# EAGLE design tomu-pro-micro (EAGLE 8.7.1)
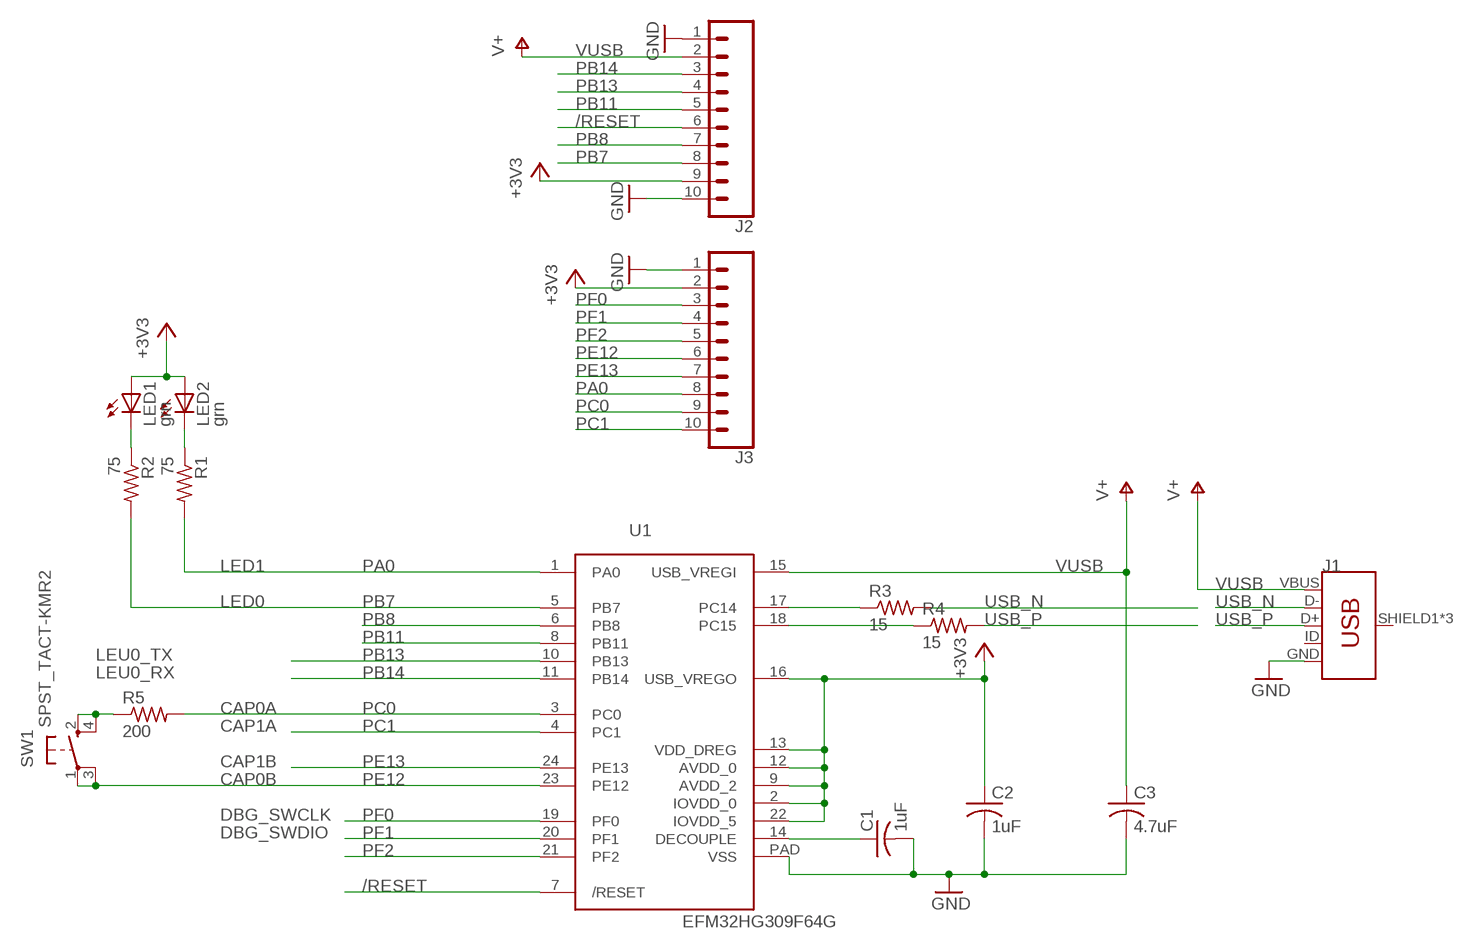
[diagram p0: schematic, sheet 1]

## Parts
C1  1uF  C-USC0603  [C0603]
C2  1uF  C-USC0603  [C0603]
C3  4.7uF  C-USC0603  [C0603]
J1  USB_MICRO-B_FEMALE-SMT  [USB-B-MICRO-SMD]
J2  CONN_10"  [1X10]
J3  CONN_10"  [1X10]
LED1  grn  LEDCHIP-LED0603  [CHIP-LED0603]
LED2  grn  LEDCHIP-LED0603  [CHIP-LED0603]
R1  75  R-US_R0603  [R0603]
R2  75  R-US_R0603  [R0603]
R3  15  R-US_R0603  [R0603]
R4  15  R-US_R0603  [R0603]
R5  200  R-US_R0603  [R0603]
SW1  SPST_TACT-KMR2  [KMR2]
U1  EFM32HG309F64G  [QFN24PAD]

## Nets
+3V3: C2.1 J2.9 J3.2 LED1.A LED2.A U1.2(IOVDD_0) U1.9(AVDD_2) U1.12(AVDD_0) U1.13(VDD_DREG) U1.16(USB_VREGO) U1.22(IOVDD_5)
/RESET: J2.6 U1.7(/RESET)
DECOUPLE: C1.1 U1.14(DECOUPLE)
GND: C1.2 C2.2 C3.2 J1.GND J2.1 J2.10 J3.1 U1.PAD(VSS)
N$4: LED1.C R2.1
N$5: LED2.C R1.1
N$20: R5.1 SW1.2(S) SW1.4(S1)
PA0: J3.8 R1.2 U1.1(PA0)
PB7: J2.8 R2.2 U1.5(PB7)
PB8: J2.7 U1.6(PB8)
PB11: J2.5 U1.8(PB11)
PB13: J2.4 U1.10(PB13)
PB14: J2.3 U1.11(PB14)
PC0: J3.9 R5.2 U1.3(PC0)
PC1: J3.10 U1.4(PC1)
PE12: J3.6 SW1.1(P) SW1.3(P1) U1.23(PE12)
PE13: J3.7 U1.24(PE13)
PF0: J3.3 U1.19(PF0)
PF1: J3.4 U1.20(PF1)
PF2: J3.5 U1.21(PF2)
RUSB_N: R3.1 U1.17(PC14)
RUSB_P: R4.1 U1.18(PC15)
USB_N: J1.D- R3.2
USB_P: J1.D+ R4.2
VUSB: C3.1 J1.VBUS J2.2 U1.15(USB_VREGI) ; supply symbol labelled V+
Unconnected: J1.ID J1.SHIELD1(SHIELD) J1.SHIELD2(SHIELD) J1.SHIELD3(SHIELD)

## Notes on the sheet
- LED1
- LED0
- LEU0_TX
- LEU0_RX
- CAP0A
- CAP1A
- CAP1B
- CAP0B
- DBG_SWCLK
- DBG_SWDIO

## Library data of the parts
C1-C3 = adafruit:C-US: CAPACITOR, American symbol
J1 = SparkFun-Connectors:USB_MICRO-B: USB Type Micro-B Connector Male/female and PTH/SMT variants SparkFun Products: SparkFun microB USB Breakout <https://www.sparkfun.com/products/12035> SparkFun USB microB Plug Breakout <https://www.sparkfun.com/products/10031> SparkFun ESP8266 Thing <https://www.sparkfun.com/products/13231>; PROD_ID: CONN-11752
J2 J3 = SparkFun-Connectors:CONN_10: Multi connection point. Often used as Generic Header-pin footprint for 0.1 inch spaced/style header connections On any of the 0.1 inch spaced packages, you can populate with these: Break Away Headers - Straight <https://www.sparkfun.com/products/116> (PRT-00116) Break Away Male Headers - Right Angle <https://www.sparkfun.com/products/553> (PRT-00553) Female Headers <https://www.sparkfun.com/products/115> (PRT-00115) Break Away Headers - Machine Pin <https://www.sparkfun.com/products/117> (PRT-00117) Break Away Female Headers - Swiss Machine Pin <https://www.sparkfun.com/products/743> (PRT-00743) Arduino Stackable Header - 10 Pin <https://www.sparkfun.com/products/11376> (PRT-11376) For SCREWTERMINALS and SPRING TERMINALS visit here: Screw Terimnals on SparkFun.com <https://www.sparkfun.com/search/results?term=Screw+Terminals> (5mm/3.5mm/2.54mm spacing) This device is also useful as a general connection point to wire up your design to another part of your project. Our various solder wires solder well into these plated through hole pads. Hook-Up Wire - Assortment (Stranded, 22 AWG) <https://www.sparkfun.com/products/11375> (PRT-11375) Hook-Up Wire - Assortment (Solid Core, 22 AWG) <https://www.sparkfun.com/products/11367> (PRT-11367) View the entire wire category on our website here <https://www.sparkfun.com/categories/141> Special notes: Molex polarized connector foot print use with SKU : PRT-08231 with associated crimp pins and housings. 1MM SMD Version SKU: PRT-10208 NOTES ON THE VARIANTS LOCK and LOCK_LONGPADS... This footprint was designed to help hold the alignment of a through-hole component (i.e. 6-pin header) while soldering it into place. You may notice that each hole has been shifted either up or down by 0.005 of an inch from it's more standard position (which is a perfectly straight line). This slight alteration caused the pins (the squares in the middle) to touch the edges of the holes. Because they are alternating, it causes a "brace" to hold the component in place. 0.005 has proven to be the perfect amount of "off-center" position when using our standard breakaway headers. Although looks a little odd when you look at the bare footprint, once you have a header in there, the alteration is very hard to notice. Also,if you push a header all the way into place, it is covered up entirely on the bottom side.; PROD_ID: CONN-11563
LED1 LED2 = adafruit:LED: LED OSRAM: - CHIPLED LG R971, LG N971, LY N971, LG Q971, LY Q971, LO R971, LY R971 LH N974, LH R974 LS Q976, LO Q976, LY Q976 LO Q996 - Hyper CHIPLED LW Q18S LB Q993, LB Q99A, LB R99A - SideLED LS A670, LO A670, LY A670, LG A670, LP A670 LB A673, LV A673, LT A673, LW A673 LH A674 LY A675 LS A676, LA A676, LO A676, LY A676, LW A676 LS A679, LY A679, LG A679 - Hyper Micro SIDELED® LS Y876, LA Y876, LO Y876, LY Y876 LT Y87S - SmartLED LW L88C, LW L88S LB L89C, LB L89S, LG L890 LS L89K, LO L89K, LY L89K LS L896, LA L896, LO L896, LY L896 - TOPLED LS T670, LO T670, LY T670, LG T670, LP T670 LSG T670, LSP T670, LSY T670, LOP T670, LYG T670 LG T671, LOG T671, LSG T671 LB T673, LV T673, LT T673, LW T673 LH T674 LS T676, LA T676, LO T676, LY T676, LB T676, LH T676, LSB T676, LW T676 LB T67C, LV T67C, LT T67C, LS T67K, LO T67K, LY T67K, LW E67C LS E67B, LA E67B, LO E67B, LY E67B, LB E67C, LV E67C, LT E67C LW T67C LS T679, LY T679, LG T679 LS T770, LO T770, LY T770, LG T770, LP T770 LB T773, LV T773, LT T773, LW T773 LH T774 LS E675, LA E675, LY E675, LS T675 LS T776, LA T776, LO T776, LY T776, LB T776 LHGB T686 LT T68C, LB T68C - Hyper Mini TOPLED® LB M676 - Mini TOPLED Santana® LG M470 LS M47K, LO M47K, LY M47K Source: http://www.osram.convergy.de/
R1-R5 = adafruit:R-US_: RESISTOR, American symbol
SW1 = adafruit:SPST_TACT: SMT 6mm switch, EVQQ2 series http://www.ladyada.net/library/eagle
U1 = todstuff:EFM32HG309F64G

## Board
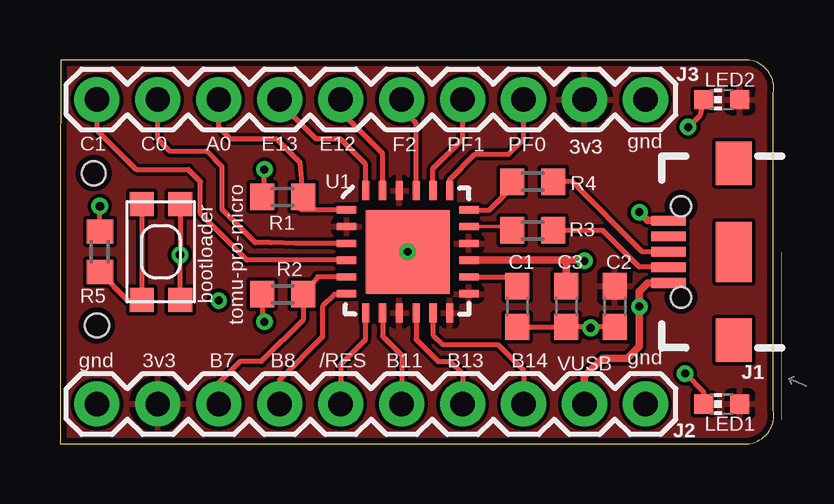
[diagram p1: board, top side]
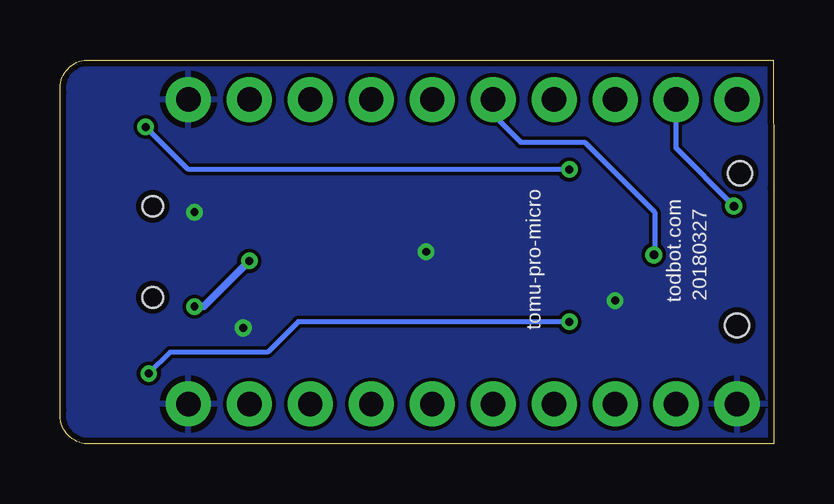
[diagram p2: board, bottom side, seen from below]

Size 29.74 x 16 mm. Coordinates in mm from the lower left corner, seen from the top.
Outline: 29.73,1.38 29.73,14.62 arc90 28.73,16 0.03,16 arc1 0.01,0 28.73,0 arc90 29.73,1.38
Copper layers (1*16): Top 0.0356mm / dielectric 1.5011mm / Bottom 0.0356mm
Design rules "LaenPCBOrderTodTent *": minimum track width 6mil, minimum drill 13mil, track to track 6mil, track to pad 6mil, pad to pad 6mil, via to via 6mil, smd to smd 6mil, copper to edge 10mil, drill to drill 6mil, minimum pad ring 7mil, minimum via ring 7mil, stop-mask expansion 3mil, vias tented up to drill 20mil, thermal gap 10mil
Holes 1 mm at 1.53,4.93 1.41,11.28

### Footprints (pad centres in the part's own frame; a part is rotated, then mirrored left to right if it is on the bottom)
C0603 = smd 1.1 x 1: 1 -0.85,0; 2 0.85,0
USB-B-MICRO-SMD = smd 1.45 x 0.4: D+ 2.725,0; D- 2.725,0.65; GND 2.725,-1.3; ID 2.725,-0.65; VBUS 2.725,1.3 | smd 1.5 x 1.8: SHIELD1 0,3.685; SHIELD2 0,-3.685 | smd 1.5 x 2.5: SHIELD3 0,0 | hole 0.85: 2.2,1.9; 2.2,-1.9
1X10 = drill 1.016 pad 1.88: 1 0,0; 2 2.54,0; 3 5.08,0; 4 7.62,0; 5 10.16,0; 6 12.7,0; 7 15.24,0; 8 17.78,0; 9 20.32,0; 10 22.86,0
CHIP-LED0603 = smd 0.8 x 0.8: A 0,-0.75; C 0,0.75
R0603 = smd 1 x 1.1: 1 -0.85,0; 2 0.85,0
KMR2 = smd 1 x 1: 1 2,0.8; 2 2,-0.8; 3 -2,0.8; 4 -2,-0.8
QFN24PAD = smd 0.8 x 0.3: 1 -2.55,1.75; 2 -2.55,1.05; 3 -2.55,0.35; 4 -2.55,-0.35; 5 -2.55,-1.05; 6 -2.55,-1.75; 13 2.55,-1.75; 14 2.55,-1.05; 15 2.55,-0.35; 16 2.55,0.35; 17 2.55,1.05; 18 2.55,1.75 | smd 0.3 x 0.8: 7 -1.75,-2.55; 8 -1.05,-2.55; 9 -0.35,-2.55; 10 0.35,-2.55; 11 1.05,-2.55; 12 1.75,-2.55; 19 1.75,2.55; 20 1.05,2.55; 21 0.35,2.55; 22 -0.35,2.55; 23 -1.05,2.55; 24 -1.75,2.55 | smd 3.5 x 3.5: PAD 0,0

### Placement (x,y rotation side)
C1  19.06,5.71 270 top
C2  23.12,5.71 270 top
C3  21.09,5.71 270 top
J1  28.08,8 180 top
J2  24.39,1.65 180 top
J3  24.39,14.35 180 top
LED1  27.57,1.65 90 top
LED2  27.57,14.35 90 top
R1  9.28,10.29 0 top
R2  9.28,6.22 0 top
R3  19.69,8.89 0 top
R4  19.69,10.92 0 top
R5  1.66,8 90 top
SW1  4.2,8 270 top
U1  14.49,8 0 top

### Tracks (layer width: path | path; a pad name or v marks a point on that pad's centre or on a via)
+3V3
  pour Top: -0.24,15.88 30.74,15.88 30.74,-0.63 -0.24,-0.63
/RESET
  Top 0.203: U1.7 12.71,5.42 12.71,4.32 11.69,3.3 J2.6
DECOUPLE
  Top 0.203: U1.14 18.67,6.95 C1.1
GND  (via drill 0.33, 0.35)
  Top 0.152: C2.2 22.15,4.86 v22.11,4.83
  Top 0.203: C1.2 C3.2 C2.2
  Top 0.305: J1.GND 24.49,9.3 v24.14,9.65
  other vias: 14.49,8 6.61,5.97
  pour Bottom: -0.24,-0.13 -0.24,16 29.73,16 29.73,-0.13
N$4  (via drill 0.33)
  Top 0.203: R2.1 8.43,5.17 v8.52,5.08 | v26.04,2.92 26.82,2.15 LED1.C
  Bottom 0.203: v8.52,5.08 19.82,5.08 21.09,3.81 25.16,3.81 v26.04,2.92
N$5  (via drill 0.33)
  Top 0.203: v26.17,13.21 26.69,13.73 LED2.C | R1.1 8.52,10.38 v8.52,11.43
  Bottom 0.203: v8.52,11.43 24.39,11.43 v26.17,13.21
N$20
  Top 0.203: SW1.4 SW1.2 2.81,6 R5.1
PA0
  Top 0.203: U1.1 10.03,9.75 R1.2 10,11.72 9.03,12.7 7.12,12.7 6.61,13.21 J3.8
PB7
  Top 0.203: U1.5 10.73,6.95 R2.2 10.13,5.17 8.39,3.43 7.5,3.43 6.61,2.54 J2.8
PB8
  Top 0.203: U1.6 11.91,6.22 11.44,6.22 10.93,5.71 10.93,5.33 10.93,4.44 9.15,2.67 J2.7
PB11
  Top 0.203: U1.8 13.44,4.48 14.23,3.68 J2.5
PB13
  Top 0.203: U1.10 14.84,4.35 15.76,3.43 16.27,3.43 16.77,2.92 J2.4
PB14
  Top 0.203: U1.11 15.54,4.54 15.95,4.13 18.23,4.13 19.31,3.05 J2.3
PC0  (via drill 0.35)
  Top 0.203: U1.3 9.82,8.35 8.77,8.38 8.14,8.38 6.74,9.78 6.74,11.56 6.11,12.19 4.58,12.19 4.07,12.7 J3.9 | R5.2 v1.66,9.91
  Bottom 0.203: J3.9 4.07,12.32 v1.66,9.91
PC1
  Top 0.203: U1.4 7.79,7.65 5.85,9.59 5.85,10.92 5.34,11.43 3.18,11.43 1.53,13.08 J3.10
PE12  (via drill 0.35)
  Top 0.203: J3.6 11.69,13.84 13.44,12.1 U1.23 | SW1.1 v5,7.87 SW1.3
  Bottom 0.203: J3.6 11.69,13.72 10.55,12.57 7.88,12.57 4.96,9.65 4.96,8.04 v5,7.87
PE13
  Top 0.203: U1.24 12.74,11.66 11.69,12.7 10.68,12.7 9.15,14.22 J3.7
PF0
  Top 0.203: U1.19 16.24,11.02 17.28,12.06 18.68,12.06 19.31,12.7 J3.3
PF1
  Top 0.203: U1.20 15.54,11.46 16.77,12.7 J3.4
PF2
  Top 0.203: J3.5 14.23,13.97 14.84,13.37 U1.21
RUSB_N
  Top 0.152: U1.17 18.68,9.05 R3.1
RUSB_P
  Top 0.203: U1.18 17.89,9.75 18.84,10.71 R4.1
USB_N
  Top 0.203: J1.D- 25.34,7.37 24.14,7.37 22.62,8.89 R3.2
USB_P
  Top 0.203: J1.D+ 24.27,8 21.35,10.92 R4.2
VUSB  (via drill 0.33)
  Top 0.203: 21.82,7.65 v21.85,7.62
  Top 0.305: J2.2 21.85,2.79 22.62,3.56 23.63,3.56 24.14,4.06 v24.14,5.71 24.14,6.35 24.49,6.7 J1.VBUS | U1.15 21.09,7.65 | 21.09,7.65 21.82,7.65 | C3.1 21.09,7.65
  Bottom 0.305: v24.14,5.71 23.76,5.71 v21.85,7.62

### Text on the board
tPlace: C1 | C0 | A0 | E13 | E12 | 3v3 | 3v3 | F2 | PF1 | PF0 | gnd | bootloader | tomu-pro-micro | gnd | 3v3 | B7 | B8 | /RES | B11 | B13 | B14 | VUSB | gnd
bPlace: 20180327 | todbot.com | tomu-pro-micro